# EAGLE design FeatherTestPointBreakout (EAGLE 9.6.2)
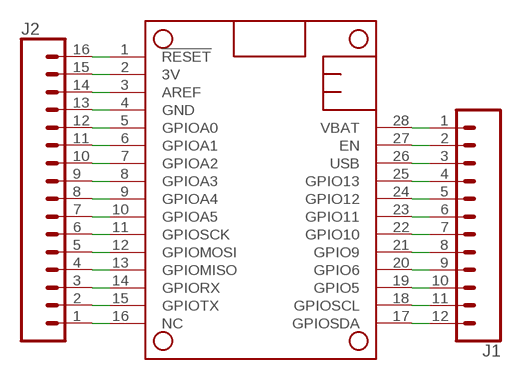
[diagram p0: schematic, sheet 1]

## Parts
J1  CONN_12  [1X12]
J2  CONN_16  [1X16]
MS1  FEATHERWINGLAYOUT  [FEATHERWING_MIN]

## Nets
3V: J2.15 MS1.2(3V)
N$1: J2.16 MS1.1(!RESET)
N$2: J2.14 MS1.3(AREF)
N$3: J2.13 MS1.4(GND)
N$4: J2.12 MS1.5(GPIOA0)
N$5: J2.11 MS1.6(GPIOA1)
N$6: J2.10 MS1.7(GPIOA2)
N$7: J2.9 MS1.8(GPIOA3)
N$8: J2.8 MS1.9(GPIOA4)
N$9: J2.7 MS1.10(GPIOA5)
N$10: J2.6 MS1.11(GPIOSCK)
N$11: J2.5 MS1.12(GPIOMOSI)
N$12: J2.4 MS1.13(GPIOMISO)
N$13: J2.3 MS1.14(GPIORX)
N$14: J2.2 MS1.15(GPIOTX)
N$15: J2.1 MS1.16(NC)
N$16: J1.12 MS1.17(GPIOSDA)
N$17: J1.11 MS1.18(GPIOSCL)
N$18: J1.10 MS1.19(GPIO5)
N$19: J1.9 MS1.20(GPIO6)
N$20: J1.8 MS1.21(GPIO9)
N$21: J1.7 MS1.22(GPIO10)
N$22: J1.6 MS1.23(GPIO11)
N$23: J1.5 MS1.24(GPIO12)
N$24: J1.4 MS1.25(GPIO13)
N$25: J1.2 MS1.27(EN)
USB: J1.3 MS1.26(USB)
VBAT: J1.1 MS1.28(VBAT)

## Library data of the parts
J1 = bschulz:CONN_12: Multi connection point. Often used as Generic Header-pin footprint for 0.1 inch spaced/style header connections On any of the 0.1 inch spaced packages, you can populate with these: Break Away Headers - Straight <https://www.sparkfun.com/products/116> (PRT-00116) Break Away Male Headers - Right Angle <https://www.sparkfun.com/products/553> (PRT-00553) Female Headers <https://www.sparkfun.com/products/115> (PRT-00115) Break Away Headers - Machine Pin <https://www.sparkfun.com/products/117> (PRT-00117) Break Away Female Headers - Swiss Machine Pin <https://www.sparkfun.com/products/743> (PRT-00743) For SCREWTERMINALS and SPRING TERMINALS visit here: Screw Terimnals on SparkFun.com <https://www.sparkfun.com/search/results?term=Screw+Terminals> (5mm/3.5mm/2.54mm spacing) This device is also useful as a general connection point to wire up your design to another part of your project. Our various solder wires solder well into these plated through hole pads. Hook-Up Wire - Assortment (Stranded, 22 AWG) <https://www.sparkfun.com/products/11375> (PRT-11375) Hook-Up Wire - Assortment (Solid Core, 22 AWG) <https://www.sparkfun.com/products/11367> (PRT-11367) View the entire wire category on our website here <https://www.sparkfun.com/categories/141> Special notes: Molex polarized connector foot print use with SKU : PRT-08231 with associated crimp pins and housings. 1MM SMD Version SKU: PRT-10208 NOTES ON THE VARIANTS LOCK and LOCK_LONGPADS... This footprint was designed to help hold the alignment of a through-hole component (i.e. 6-pin header) while soldering it into place. You may notice that each hole has been shifted either up or down by 0.005 of an inch from it's more standard position (which is a perfectly straight line). This slight alteration caused the pins (the squares in the middle) to touch the edges of the holes. Because they are alternating, it causes a "brace" to hold the component in place. 0.005 has proven to be the perfect amount of "off-center" position when using our standard breakaway headers. Although looks a little odd when you look at the bare footprint, once you have a header in there, the alteration is very hard to notice. Also,if you push a header all the way into place, it is covered up entirely on the bottom side.
J2 = bschulz:CONN_16: Multi connection point. Often used as Generic Header-pin footprint for 0.1 inch spaced/style header connections On any of the 0.1 inch spaced packages, you can populate with these: Break Away Headers - Straight <https://www.sparkfun.com/products/116> (PRT-00116) Break Away Male Headers - Right Angle <https://www.sparkfun.com/products/553> (PRT-00553) Female Headers <https://www.sparkfun.com/products/115> (PRT-00115) Break Away Headers - Machine Pin <https://www.sparkfun.com/products/117> (PRT-00117) Break Away Female Headers - Swiss Machine Pin <https://www.sparkfun.com/products/743> (PRT-00743) For SCREWTERMINALS and SPRING TERMINALS visit here: Screw Terimnals on SparkFun.com <https://www.sparkfun.com/search/results?term=Screw+Terminals> (5mm/3.5mm/2.54mm spacing) This device is also useful as a general connection point to wire up your design to another part of your project. Our various solder wires solder well into these plated through hole pads. Hook-Up Wire - Assortment (Stranded, 22 AWG) <https://www.sparkfun.com/products/11375> (PRT-11375) Hook-Up Wire - Assortment (Solid Core, 22 AWG) <https://www.sparkfun.com/products/11367> (PRT-11367) View the entire wire category on our website here <https://www.sparkfun.com/categories/141> Special notes: Molex polarized connector foot print use with SKU : PRT-08231 with associated crimp pins and housings. 1MM SMD Version SKU: PRT-10208 NOTES ON THE VARIANTS LOCK and LOCK_LONGPADS... This footprint was designed to help hold the alignment of a through-hole component (i.e. 6-pin header) while soldering it into place. You may notice that each hole has been shifted either up or down by 0.005 of an inch from it's more standard position (which is a perfectly straight line). This slight alteration caused the pins (the squares in the middle) to touch the edges of the holes. Because they are alternating, it causes a "brace" to hold the component in place. 0.005 has proven to be the perfect amount of "off-center" position when using our standard breakaway headers. Although looks a little odd when you look at the bare footprint, once you have a header in there, the alteration is very hard to notice. Also,if you push a header all the way into place, it is covered up entirely on the bottom side.
MS1 = bschulz:FEATHERWING

## Board
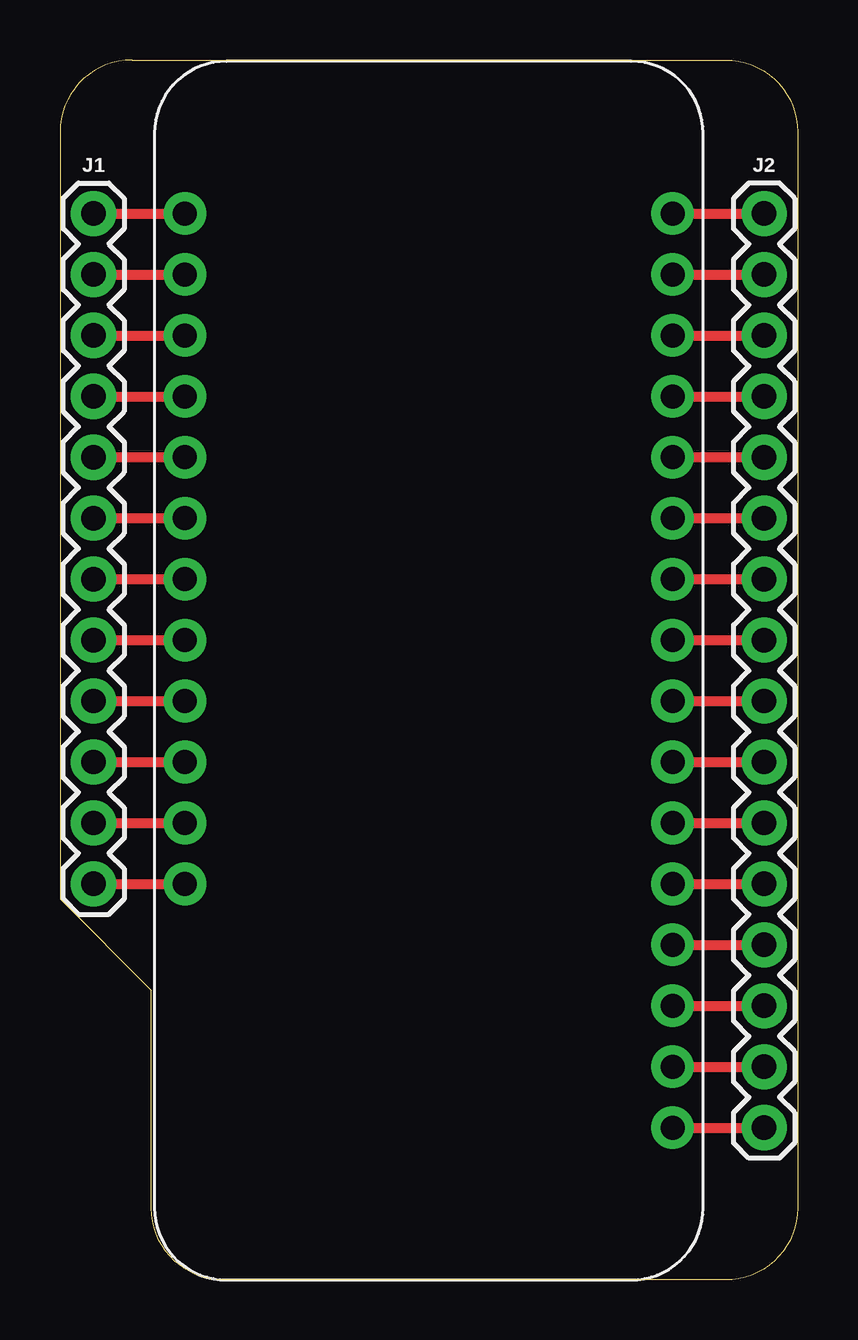
[diagram p1: board, top side]

Size 30.73 x 50.85 mm. Coordinates in mm from the lower left corner, seen from the top.
Outline: 30.73,6.35 30.73,3 arc-90 27.73,0 6.81,0 arc-90 3.81,3 3.81,12.06 0,15.88 0,47.85 arc-90 3,50.85 27.73,50.85 arc-90 30.73,47.85 30.73,6.35
Outline: 30.73,6.35 30.73,5.71
Copper layers (1*16): Top 0.035559375mm / dielectric 1.6mm / Bottom 0.035559375mm
Design rules "oshpark-2layer": minimum track width 6mil, minimum drill 10mil, track to track 6mil, track to pad 6mil, pad to pad 6mil, via to via 6mil, smd to smd 6mil, copper to edge 15mil, drill to drill 6mil, minimum pad ring 5mil, minimum via ring 5mil, stop-mask expansion 2.5mil, vias tented up to drill 0mil, thermal gap 10mil

### Footprints (pad centres in the part's own frame; a part is rotated, then mirrored left to right if it is on the bottom)
1X12 = drill 1.016 pad 1.88: 1 0,0; 2 2.54,0; 3 5.08,0; 4 7.62,0; 5 10.16,0; 6 12.7,0; 7 15.24,0; 8 17.78,0; 9 20.32,0; 10 22.86,0; 11 25.4,0; 12 27.94,0
1X16 = drill 1.016 pad 1.88: 1 0,0; 2 2.54,0; 3 5.08,0; 4 7.62,0; 5 10.16,0; 6 12.7,0; 7 15.24,0; 8 17.78,0; 9 20.32,0; 10 22.86,0; 11 25.4,0; 12 27.94,0; 13 30.48,0; 14 33.02,0; 15 35.56,0; 16 38.1,0
FEATHERWING_MIN = drill 1 pad 1.778: 1 6.35,1.27; 2 8.89,1.27; 3 11.43,1.27; 4 13.97,1.27; 5 16.51,1.27; 6 19.05,1.27; 7 21.59,1.27; 8 24.13,1.27; 9 26.67,1.27; 10 29.21,1.27; 11 31.75,1.27; 12 34.29,1.27; 13 36.83,1.27; 14 39.37,1.27; 15 41.91,1.27; 16 44.45,1.27; 17 44.45,21.59; 18 41.91,21.59; 19 39.37,21.59; 20 36.83,21.59; 21 34.29,21.59; 22 31.75,21.59; 23 29.21,21.59; 24 26.67,21.59; 25 24.13,21.59; 26 21.59,21.59; 27 19.05,21.59; 28 16.51,21.59

### Placement (x,y rotation side)
J1  1.4,16.51 90 top
J2  29.34,44.45 270 top
MS1  26.8,0 90 top

### Tracks (layer width: path | path; a pad name or v marks a point on that pad's centre or on a via)
3V
  Top 0.406: MS1.2 J2.15
N$1
  Top 0.406: MS1.1 J2.16
N$2
  Top 0.406: MS1.3 J2.14
N$3
  Top 0.406: MS1.4 J2.13
N$4
  Top 0.406: MS1.5 J2.12
N$5
  Top 0.406: MS1.6 J2.11
N$6
  Top 0.406: MS1.7 J2.10
N$7
  Top 0.406: MS1.8 J2.9
N$8
  Top 0.406: MS1.9 J2.8
N$9
  Top 0.406: MS1.10 J2.7
N$10
  Top 0.406: MS1.11 J2.6
N$11
  Top 0.406: MS1.12 J2.5
N$12
  Top 0.406: MS1.13 J2.4
N$13
  Top 0.406: MS1.14 J2.3
N$14
  Top 0.406: MS1.15 J2.2
N$15
  Top 0.406: MS1.16 J2.1
N$16
  Top 0.406: J1.12 MS1.17
N$17
  Top 0.406: J1.11 MS1.18
N$18
  Top 0.406: J1.10 MS1.19
N$19
  Top 0.406: J1.9 MS1.20
N$20
  Top 0.406: J1.8 MS1.21
N$21
  Top 0.406: J1.7 MS1.22
N$22
  Top 0.406: J1.6 MS1.23
N$23
  Top 0.406: J1.5 MS1.24
N$24
  Top 0.406: J1.4 MS1.25
N$25
  Top 0.406: J1.2 MS1.27
USB
  Top 0.406: J1.3 MS1.26
VBAT
  Top 0.406: J1.1 MS1.28

### Text on the board
tDocu: Feather / Test Point / Breakout / v0.0
bDocu: Break44 / B. Schulz / 2020-07-09